# EAGLE design PAD1v2 (EAGLE 7.1.0)
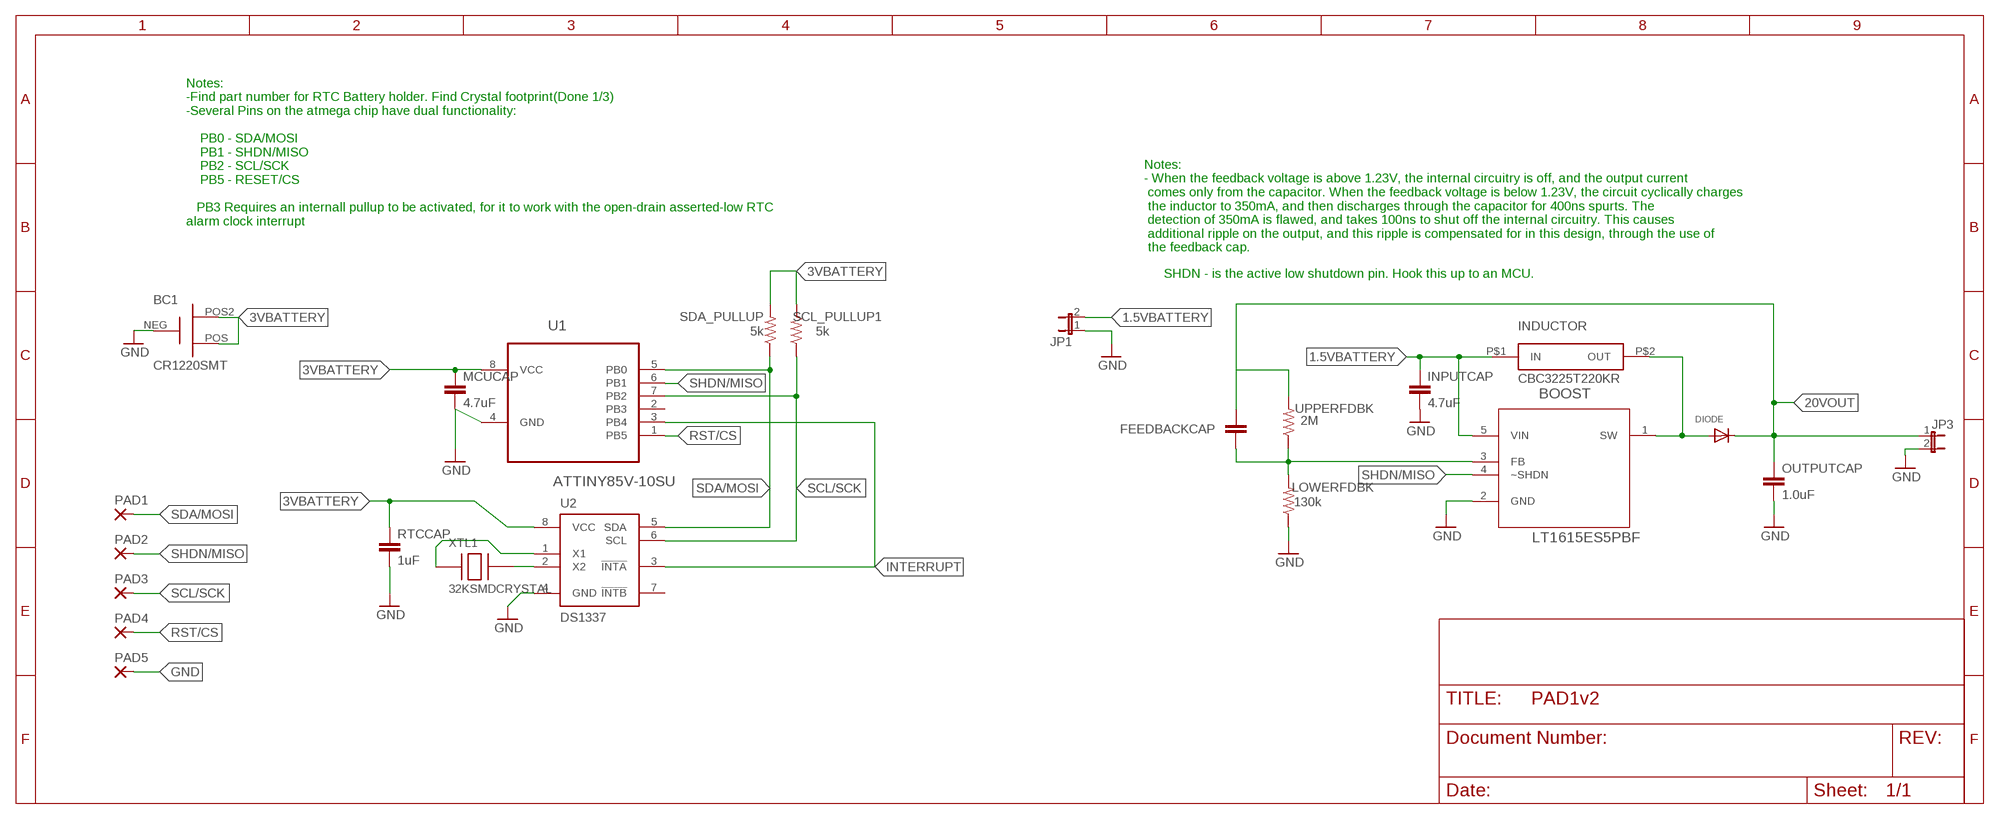
[diagram p0: schematic, sheet 1]

## Parts
BC1  CR1220SMT  [3000TR]
BOOST  LT1615ES5PBF  [SOT95P280X145-5N]
DIODE  DIODESOD-123  [SOD-123]
FEEDBACKCAP  4.7pF  CAP1206  [1206]
INDUCTOR  CBC3225T220KR  [1210]
INPUTCAP  4.7uF  CAP1206  [1206]
JP1  JUMPER-2PTH  [1X02]
JP3  JUMPER-2PTH_LOCK  [1X02_LOCK]
LOWERFDBK  130k  RESISTOR1206  [1206]
MCUCAP  4.7uF  CAP1206  [1206]
OUTPUTCAP  1.0uF  CAP1206  [1206]
PAD1  1,6/0,8  [1,6/0,8]
PAD2  1,6/0,8  [1,6/0,8]
PAD3  1,6/0,8  [1,6/0,8]
PAD4  1,6/0,8  [1,6/0,8]
PAD5  1,6/0,8  [1,6/0,8]
RTCCAP  1uF  CAP1206  [1206]
SCL_PULLUP1  5k  RESISTOR1206  [1206]
SDA_PULLUP  5k  RESISTOR1206  [1206]
U1  ATTINY85V-10SU  [SOIC127P798X216-8N]
U2  DS1337  [UMAX8]
UPPERFDBK  2M  RESISTOR1206  [1206]
XTL1  32KSMDCRYSTAL  [4-SMD]

## Nets
1.5VBATTERY: BOOST.5(VIN) INDUCTOR.P$1(IN) INPUTCAP.1 JP1.2
3VBATTERY: BC1.POS BC1.POS2 MCUCAP.1 RTCCAP.1 SCL_PULLUP1.2 SDA_PULLUP.2 U1.8(VCC) U2.8(VCC)
20VOUT: DIODE.C FEEDBACKCAP.1 JP3.1 OUTPUTCAP.1 UPPERFDBK.2
GND: BC1.NEG BOOST.2(GND) INPUTCAP.2 JP1.1 JP3.2 LOWERFDBK.1 MCUCAP.2 OUTPUTCAP.2 PAD5.1(P) RTCCAP.2 U1.4(GND) U2.4(GND)
INTERRUPT: U1.3(PB4) U2.3(!INTA)
N$1: BOOST.1(SW) DIODE.A INDUCTOR.P$2(OUT)
N$2: BOOST.3(FB) FEEDBACKCAP.2 LOWERFDBK.2 UPPERFDBK.1
N$3: U2.2(X2) XTL1.XTAL2
N$4: U2.1(X1) XTL1.XTAL1
RST/CS: PAD4.1(P) U1.1(PB5)
SCL/SCK: PAD3.1(P) SCL_PULLUP1.1 U1.7(PB2) U2.6(SCL)
SDA/MOSI: PAD1.1(P) SDA_PULLUP.1 U1.5(PB0) U2.5(SDA)
SHDN/MISO: BOOST.4(~SHDN) PAD2.1(P) U1.6(PB1)
Unconnected: U1.2(PB3) U2.7(!INTB)

## Notes on the sheet
- Notes:
  -Find part number for RTC Battery holder. Find Crystal footprint(Done 1/3)
  -Several Pins on the atmega chip have dual functionality:
  
      PB0 - SDA/MOSI 
      PB1 - SHDN/MISO
      PB2 - SCL/SCK
      PB5 - RESET/CS
  
     PB3 Requires an internall pullup to be activated, for it to work with the open-drain asserted-low RTC 
  alarm clock interrupt
- Notes:
  - When the feedback voltage is above 1.23V, the internal circuitry is off, and the output current
   comes only from the capacitor. When the feedback voltage is below 1.23V, the circuit cyclically charges
   the inductor to 350mA, and then discharges through the capacitor for 400ns spurts. The
   detection of 350mA is flawed, and takes 100ns to shut off the internal circuitry. This causes
   additional ripple on the output, and this ripple is compensated for in this design, through the use of
   the feedback cap.
- SHDN - is the active low shutdown pin. Hook this up to an MCU.

## Library data of the parts
BC1 = fishlib:CR1220SMT: CR1220 Surface Mount Battery holder http://www.digikey.com/product-detail/en/3000TR/3000KCT-ND/1532229
BOOST = LTC_By_element14_Batch_1:LT1615ES5PBF: DC/DC Converter; MPN: LT1615ES5#PBF; OC_FARNELL: 1531485; OC_NEWARK: 61M3349; PACKAGE: SOT-23-5; SUPPLIER: Linear Technology
DIODE = Adafruit:DIODE: Diode SMADIODE - SMA Surface Mount Package 20V 1A Schottky Diode Digikey: 641-1014-6-ND DO-1N4148 - Through Hole Small Current Diode SOD-123 20V 1 A (.5mV Vf) Schottky Diode - Digikey: MBRX120TPMSCT-ND SOD-323 10V 570mA (.38mV Vf, 3ns) Schottky Diode - Digikey: ZLLS410CT-ND SOD-523 30V 30mA Schottky Diode (RB751S-40TE61) - Digikey: RB751S-40TE61CT-ND SOT23-R/W - SOT23 Package (R = Solder Paste/Reflow Ovens, W = Hand-Soldering) BAT54Film 40V 300mA - Digikey: 497-7162-1-ND
FEEDBACKCAP INPUTCAP MCUCAP OUTPUTCAP RTCCAP = SparkFun-Passives:CAP: Capacitor Standard 0603 ceramic capacitor, and 0.1" leaded capacitor.
INDUCTOR = FishCustom:CBC3225T220KR
JP1 JP3 = SparkFun-Retired:JUMPER-2: Jumper Basic 0.1" spaced jumper. Use with breakaway headers.
LOWERFDBK SCL_PULLUP1 SDA_PULLUP UPPERFDBK = SparkFun-Passives:RESISTOR: Resistor Basic schematic elements and footprints for 0603, 1206, and PTH resistors.
PAD1-PAD5 = wirepad:1,6/0,8: THROUGH-HOLE PAD
U1 = Atmel_By_element14_Batch_1-00:ATTINY85V-10SU: 8-bit Microcontroller with In-System Programmable Flash; MPN: ATTINY85V-10SU; OC_FARNELL: 1455166; OC_NEWARK: 58M3799; PACKAGE: SOIC-8; SUPPLIER: Atmel
U2 = ds1337:DS1337: Real-time clock IC
XTL1 = FishCustom2:32KSMDCRYSTAL

## Board
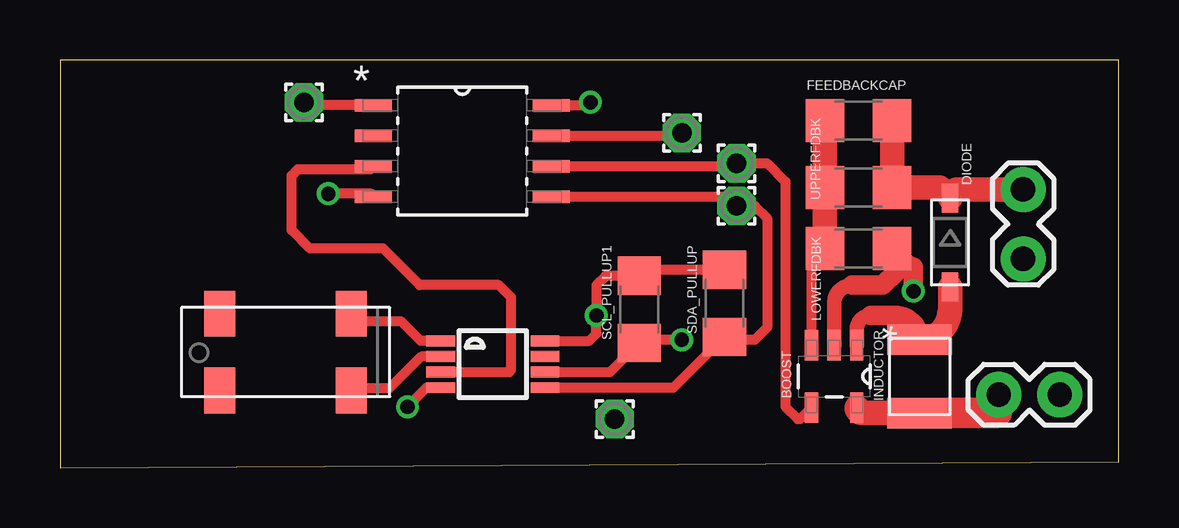
[diagram p1: board, top side]
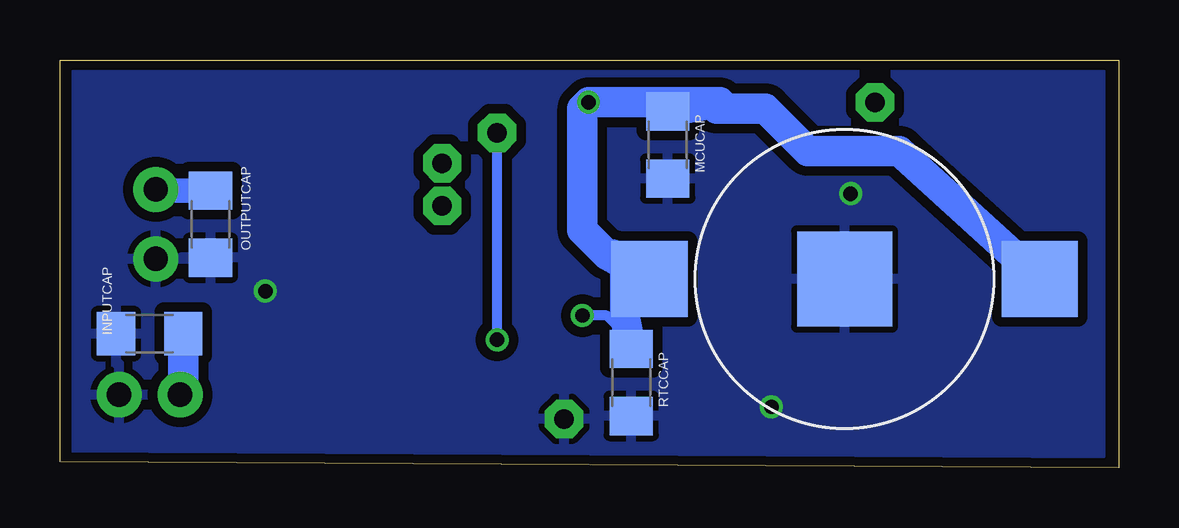
[diagram p2: board, bottom side, seen from below]

Size 44.12 x 17.01 mm. Coordinates in mm from the lower left corner, seen from the top.
Outline: 0,0 44.12,0.25 44.12,17.01 0,17.01 0,0
Copper layers (1*16): Top 0.0356mm / dielectric 1.5011mm / Bottom 0.0356mm
Design rules "LaenPCBOrder": minimum track width 6mil, minimum drill 13mil, track to track 6mil, track to pad 6mil, pad to pad 6mil, via to via 6mil, smd to smd 6mil, copper to edge 15mil, drill to drill 6mil, minimum pad ring 7mil, minimum via ring 7mil, stop-mask expansion 3mil, vias tented up to drill 0mil, thermal gap 10mil

### Footprints (pad centres in the part's own frame; a part is rotated, then mirrored left to right if it is on the bottom)
3000TR = smd 3.962 x 3.962: NEG 0,0 | smd 3.175 x 3.175: POS 8.128,0; POS2 -8.128,0
SOT95P280X145-5N = smd 1.27 x 0.559: 1 -1.295,0.94; 2 -1.295,0; 3 -1.295,-0.94; 4 1.295,-0.94; 5 1.295,0.94
SOD-123 = smd 1.2 x 0.7: A 1.85,0; C -1.85,0
1206 = smd 1.6 x 1.8: 1 -1.4,0; 2 1.4,0
1210 = smd 1.27 x 2.692: P$1 -1.524,0; P$2 1.524,0
1X02 = drill 1.016 pad 1.88: 1 0,0; 2 2.54,0
1X02_LOCK = drill 1.016 pad 1.88: 1 -0.178,0; 2 2.718,0
1,6/0,8 = drill 0.813 pad 1.6 octagon: 1 0,0
SOIC127P798X216-8N = smd 1.549 x 0.533: 1 -3.708,1.905; 2 -3.708,0.635; 3 -3.708,-0.635; 4 -3.708,-1.905; 5 3.708,-1.905; 6 3.708,-0.635; 7 3.708,0.635; 8 3.708,1.905
UMAX8 = smd 0.45 x 1.2: 1 -0.975,-2.175; 2 -0.325,-2.175; 3 0.325,-2.175; 4 0.975,-2.175; 5 0.975,2.175; 6 0.325,2.175; 7 -0.325,2.175; 8 -0.975,2.175
4-SMD = smd 1.295 x 1.905: NC1 2.743,-1.6; NC2 2.743,1.6; XTAL1 -2.743,-1.6; XTAL2 -2.743,1.6

### Placement (x,y rotation side)
BC1  11.43,7.87 180 bottom
BOOST  32.26,3.81 270 top
DIODE  37.08,9.4 270 top
FEEDBACKCAP  33.27,14.48 180 top
INDUCTOR  35.81,3.81 90 top
INPUTCAP  40.39,5.59 180 bottom
JP1  41.66,3.05 180 top
JP3  40.13,11.43 270 top
LOWERFDBK  33.27,9.14 180 top
MCUCAP  18.8,13.46 270 bottom
OUTPUTCAP  37.85,10.16 270 bottom
PAD1  28.19,10.92 0 top
PAD2  28.19,12.7 0 top
PAD3  25.91,13.97 0 top
PAD4  10.16,15.24 0 top
PAD5  23.11,2.03 0 top
RTCCAP  20.32,3.56 270 bottom
SCL_PULLUP1  24.13,6.6 90 top
SDA_PULLUP  27.69,6.86 90 top
U1  16.76,13.21 0 top
U2  18.03,4.32 270 top
UPPERFDBK  33.27,11.68 0 top
XTL1  9.4,4.83 180 top

### Tracks (layer width: path | path; a pad name or v marks a point on that pad's centre or on a via)
1.5VBATTERY
  Top 0.406: 33.27,2.44 BOOST.5 | 35.59,2.52 INDUCTOR.P$1
  Top 1.016: BOOST.5 arc90 33.43,2.29 INDUCTOR.P$1 | JP1.2 arc-90 39.04,2.97
  Top 1.27: 39.04,2.97 39.04,2.29 INDUCTOR.P$1
  Bottom 0.406: 38.99,3.18 JP1.2
  Bottom 1.27: INPUTCAP.1 38.99,3.18
3VBATTERY  (via drill 0.6)
  Top 0.406: U2.8 22.06,5.29 22.35,5.59 v22.35,6.35 22.35,7.62 22.74,8 SCL_PULLUP1.2 24.89,8.26 SDA_PULLUP.2 | U1.8 21.97,15.11 v22.1,15.24
  Bottom 0.406: RTCCAP.1 20.96,5.97 21.34,6.35 v22.35,6.35
  Bottom 1.27: BC1.POS 21.34,8.89 | RTCCAP.1 20.57,6.23 20.57,8.38 21.08,8.89 21.34,8.89 | 17.02,15.24 v22.1,15.24 22.35,14.99 22.35,9.91 21.34,8.89 | 17.02,15.24 16.63,15.24 MCUCAP.1 | BC1.POS2 9.14,13.21 12.95,13.21 14.73,14.99 16.76,14.99 17.02,15.24
20VOUT
  Top 0.406: 36.65,11.68 DIODE.C
  Top 1.016: DIODE.C arc-90 37.44,11.61 JP3.1 | 36.65,11.68 UPPERFDBK.2 FEEDBACKCAP.1
  Bottom 0.406: 40.08,11.56 JP3.1
  Bottom 1.016: OUTPUTCAP.1 40.08,11.56
GND  (via drill 0.6)
  Top 0.406: 34.8,8.13 34.8,9.02 LOWERFDBK.1 | U2.4 15.28,3.34 v14.48,2.54 | U1.4 arc90 12.93,11.43 v11.18,11.43
  Top 0.61: BOOST.2 32.26,6.86 arc-90 33.02,7.62 | 34.8,9.02 34.92,9.02 35.56,8.38
  Top 0.813: 33.02,7.62 34.29,7.62 34.8,8.13 | 35.56,8.38 v35.56,7.37
  pour Bottom (isolate 0.406): 0.76,16.51 43.43,16.51 43.43,0.51 0.76,0.51
INTERRUPT
  Top 0.406: U2.3 18.73,3.99 18.8,4.06 18.8,7.11 18.29,7.62 14.99,7.62 13.46,9.14 10.41,9.14 9.65,9.91 9.65,12.19 9.91,12.45 12.93,12.45 U1.3
N$1
  Top 0.61: 33.78,6.35 arc90 33.2,5.77 BOOST.1
  Top 0.813: 33.78,6.35 34.8,6.35 arc-90 INDUCTOR.P$2
  Top 1.016: INDUCTOR.P$2 arc90 37.08,6.6 DIODE.A
N$2
  Top 0.406: BOOST.3 31.32,8.59 LOWERFDBK.2
  Top 1.016: FEEDBACKCAP.2 UPPERFDBK.1 LOWERFDBK.2
N$3
  Top 0.406: U2.2 15.06,4.64 13.72,3.3 12.22,3.3 XTL1.XTAL2
N$4
  Top 0.406: U2.1 15.03,5.29 14.22,6.1 12.47,6.1 XTL1.XTAL1
RST/CS
  Top 0.406: U1.1 10.29,15.11 PAD4.1
SCL/SCK  (via drill 0.6)
  Top 0.406: v25.91,5.33 24.77,5.33 SCL_PULLUP1.1 22.92,3.99 U2.6 | U1.7 26.04,13.84 PAD3.1
  Bottom 0.406: v25.91,5.33 PAD3.1
SDA/MOSI
  Top 0.406: U1.5 27.81,11.3 PAD1.1 28.96,10.92 29.46,10.41 29.46,5.84 28.96,5.33 27.81,5.33 SDA_PULLUP.1 25.57,3.34 U2.5
SHDN/MISO
  Top 0.406: U1.6 28.07,12.57 PAD2.1 29.46,12.7 30.23,11.94 30.23,2.54 30.73,2.03 30.84,2.03 BOOST.4